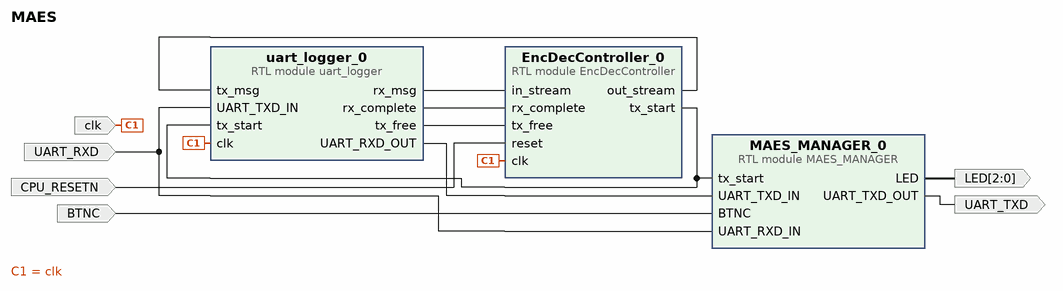
[diagram p0: block diagram of the top level]
# Vivado block design MAES, xc7a100tcsg324-1, Vivado 2020.2
create_bd_design MAES

create_bd_port -dir O -from 2 -to 0 -type data LED
create_bd_port -dir I BTNC
create_bd_port -dir I -type data UART_RXD
create_bd_port -dir O -type data UART_TXD
create_bd_port -dir I -type rst CPU_RESETN
set_property -dict {CONFIG.POLARITY ACTIVE_LOW} [get_bd_ports CPU_RESETN]
create_bd_port -dir I -type clk clk
set_property -dict {CONFIG.FREQ_HZ 100000000 CONFIG.PHASE 0.000} [get_bd_ports clk]

create_bd_cell -type module -reference EncDecController EncDecController_0
create_bd_cell -type module -reference MAES_MANAGER MAES_MANAGER_0
create_bd_cell -type module -reference uart_logger uart_logger_0

# ---- connections ----

connect_bd_net [get_bd_pins EncDecController_0/out_stream] [get_bd_pins uart_logger_0/tx_msg]
connect_bd_net [get_bd_pins EncDecController_0/tx_start] [get_bd_pins MAES_MANAGER_0/tx_start] [get_bd_pins uart_logger_0/tx_start]
connect_bd_net [get_bd_pins uart_logger_0/rx_msg] [get_bd_pins EncDecController_0/in_stream]
connect_bd_net [get_bd_pins uart_logger_0/rx_complete] [get_bd_pins EncDecController_0/rx_complete]
connect_bd_net [get_bd_pins uart_logger_0/tx_free] [get_bd_pins EncDecController_0/tx_free]
connect_bd_net [get_bd_pins MAES_MANAGER_0/LED] [get_bd_ports LED]
connect_bd_net [get_bd_ports BTNC] [get_bd_pins MAES_MANAGER_0/BTNC]
connect_bd_net [get_bd_pins uart_logger_0/UART_RXD_OUT] [get_bd_pins MAES_MANAGER_0/UART_TXD_IN]
connect_bd_net [get_bd_pins MAES_MANAGER_0/UART_TXD_OUT] [get_bd_ports UART_TXD]
connect_bd_net [get_bd_ports UART_RXD] [get_bd_pins MAES_MANAGER_0/UART_RXD_IN] [get_bd_pins uart_logger_0/UART_TXD_IN]
connect_bd_net -net clk_wiz_0_clk_out1 [get_bd_ports clk] [get_bd_pins EncDecController_0/clk] [get_bd_pins uart_logger_0/clk]
connect_bd_net -net reset_1 [get_bd_ports CPU_RESETN] [get_bd_pins EncDecController_0/reset]

validate_bd_design
save_bd_design
